# Altium schematic sheet MCU.SchDoc
size A4; SheetNumber: 2; SheetTotal: 4
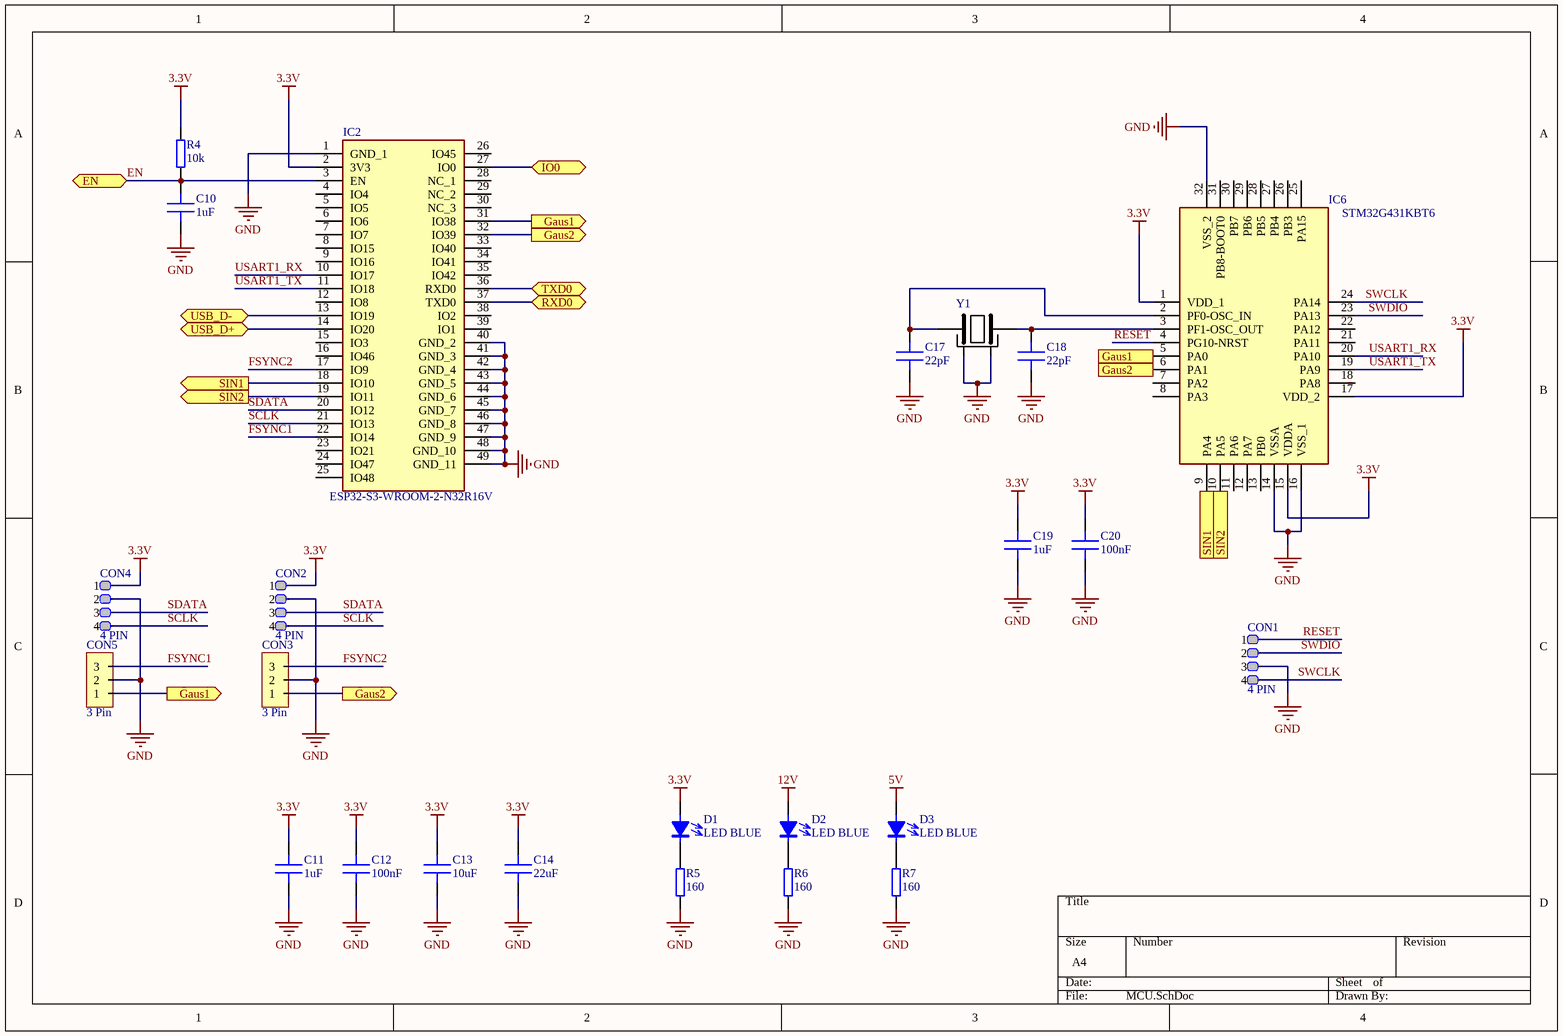
[diagram p0: MCU.SchDoc]

## Parts
C10  1uF  [C 0402]
C11  1uF  [C 0402]
C12  100nF  [C 0402]
C13  10uF  [C 0402]
C14  22uF  [C 0402]
C17  22pF  [C 0402]
C18  22pF  [C 0402]
C19  1uF  [C 0402]
C20  100nF  [C 0402]
CON1  4 PIN  [SM04B-SRSS-TB]
CON2  4 PIN  [Goldpin 2.54 4P]
CON3  3 Pin  [Goldpin 2.54 3P]
CON4  4 PIN  [Goldpin 2.54 4P]
CON5  3 Pin  [Goldpin 2.54 3P]
D1  LED BLUE  [LED 0603 BLUE]
D2  LED BLUE  [LED 0603 BLUE]
D3  LED BLUE  [LED 0603 BLUE]
IC2  ESP32-S3-WROOM-2-N32R16V  [ESP32S3WROOM2N32R16V]
IC6  STM32G431KBT6  [QFP80P900X900X160-32N]
R4  10k  [R 0402]
R5  160  [R 0402]
R6  160  [R 0402]
R7  160  [R 0402]
Y1  MCSJK-7U-16.00-12-30-80-B-30  [MCSJK7U1600123080B30]  (value not drawn)

## Ports
EN (bidir), Gaus1 (out), Gaus2 (out), IO0 (bidir), RXD0 (bidir), SIN1 (out), SIN2 (out), TXD0 (bidir), USB_D+ (bidir), USB_D- (bidir)

## Nets
3.3V: C11.1 C12.1 C13.1 C14.1 C19.1 C20.1 CON2.1 CON4.1 D1.1 IC2.2(3V3) IC6.1(VDD_1) IC6.15(VDDA) IC6.17(VDD_2) R4.2
5V: D3.1
12V: D2.1
GND: C10.2 C11.2 C12.2 C13.2 C14.2 C17.2 C18.2 C19.2 C20.2 CON1.3 CON2.2 CON3.2 CON4.2 CON5.2 IC2.1(GND_1) IC2.40(GND_2) IC2.41(GND_3) IC2.42(GND_4) IC2.43(GND_5) IC2.44(GND_6) IC2.45(GND_7) IC2.46(GND_8) IC2.47(GND_9) IC2.48(GND_10) IC2.49(GND_11) IC6.14(VSSA) IC6.16(VSS_1) IC6.32(VSS_2) R5.1 R6.1 R7.1 Y1.2(GND_1) Y1.4(GND_2)
EN: C10.1 IC2.3(EN) R4.1 ; port EN
FSYNC1: CON5.3 IC2.22(IO14)
FSYNC2: CON3.3 IC2.17(IO9)
Gaus1: CON5.1 IC2.31(IO38) IC6.5(PA0) ; port Gaus1
Gaus2: CON3.1 IC2.32(IO39) IC6.6(PA1) ; port Gaus2
IO0: IC2.27(IO0) ; port IO0
RESET: CON1.1 IC6.4(PG10-NRST)
RXD0: IC2.37(TXD0) ; port RXD0
SCLK: CON2.4 CON4.4 IC2.21(IO13)
SDATA: CON2.3 CON4.3 IC2.20(IO12)
SIN1: IC2.18(IO10) IC6.9(PA4) ; port SIN1
SIN2: IC2.19(IO11) IC6.10(PA5) ; port SIN2
SWCLK: CON1.4 IC6.24(PA14)
SWDIO: CON1.2 IC6.23(PA13)
TXD0: IC2.36(RXD0) ; port TXD0
USART1_RX: IC2.10(IO17) IC6.20(PA10)
USART1_TX: IC2.11(IO18) IC6.19(PA9)
USB_D+: IC2.14(IO20) ; port USB_D+
USB_D-: IC2.13(IO19) ; port USB_D-
NetC17_1: C17.1 IC6.2(PF0-OSC_IN) Y1.1(CRYSTAL_1)
NetC18_1: C18.1 IC6.3(PF1-OSC_OUT) Y1.3(CRYSTAL_2)
NetD1_2: D1.2 R5.2
NetD2_2: D2.2 R6.2
NetD3_2: D3.2 R7.2

Not connected (* = marked no-connect by the designer): IC2 4(IO4) 5(IO5) 6(IO6) 7(IO7) 8(IO15) 9(IO16) 12(IO8) 15(IO3) 16(IO46) 23(IO21) 24(IO47) 25(IO48) 26(IO45) 28(NC_1) 29(NC_2) 30(NC_3) 33(IO40) 34(IO41) 35(IO42) 38(IO2) 39(IO1); IC6 7(PA2) 8(PA3) 11(PA6) 12(PA7) 13(PB0) 18(PA8) 21(PA11) 22(PA12) 25(PA15) 26(PB3) 27(PB4) 28(PB5) 29(PB6) 30(PB7) 31(PB8-BOOT0)

## Library data of the parts
C10-C14 C17-C20 = Capacitor: MLCC Capacitor
IC2 = ESP32-S3-WROOM-2-N32R16V: Integrated Circuit; Manufacturer_Name: Espressif Systems; Datasheet Link: https://www.digikey.in/en/products/detail/espressif-systems/ESP32-S3-WROOM-2-N32R16V/25811280; Height: 3.25mm; Manufacturer_Part_Number: ESP32-S3-WROOM-2-N32R16V; Mouser Part Number: 356-SP32S3WM2N32R16V; Mouser Price/Stock: https://www.mouser.co.uk/ProductDetail/Espressif-Systems/ESP32-S3-WROOM-2-N32R16V?qs=%252BHhoWzUJg4Kf%2FwmS40wg%252BQ%3D%3D
IC6 = STM32G431KBT6: Integrated Circuit; Manufacturer_Name: STMicroelectronics; Datasheet Link: https://www.st.com/resource/en/datasheet/stm32g431kb.pdf; Height: 1.6mm; Manufacturer_Part_Number: STM32G431KBT6; Mouser Part Number: 511-STM32G431KBT6; Mouser Price/Stock: https://www.mouser.co.uk/ProductDetail/STMicroelectronics/STM32G431KBT6?qs=T3oQrply3y8teCTeNAFOLg%3D%3D; Arrow Part Number: STM32G431KBT6; Arrow Price/Stock: https://www.arrow.com/en/products/stm32g431kbt6/stmicroelectronics
R4-R7 = Resistor: General pourpouse resistor
Y1 = MCSJK-7U-16.00-12-30-80-B-30: Crystal or Oscillator; Manufacturer_Name: MULTICOMP; Datasheet Link: https://www.farnell.com/datasheets/2864166.pdf; Height: 0.8mm; Manufacturer_Part_Number: MCSJK-7U-16.00-12-30-80-B-30